# EAGLE design Moduł_Wyświetlacza (EAGLE 9.6.2)
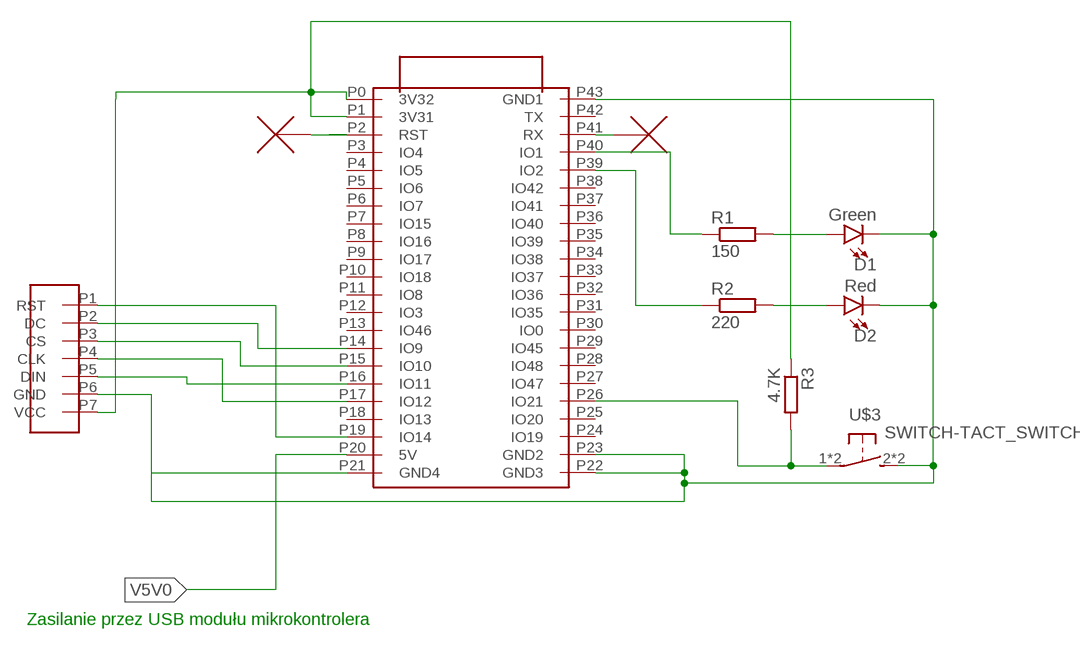
[diagram p0: schematic, sheet 1]

## Parts
D1  Green  SPARKFUN-LED_LED5MM  [SPARKFUN-LED_LED_5MM]
D2  Red  SPARKFUN-LED_LED5MM  [SPARKFUN-LED_LED_5MM]
R1  150  R-EU_0204/7  [0204/7]
R2  220  R-EU_0204/7  [0204/7]
R3  4.7K  R-EU_0204/7  [0204/7]
U$1  PROJEKT_SE5_ESP32-S3-DEVKIT  [PROJEKT_SE5_ESP32-S3-DEVKIT]
U$2  PROJEKT_SE5_OLED_MODULE  [PROJEKT_SE5_1.5INC_RGB_OLED]
U$3  SWITCH-TACT_SWITCH  [SWITCH-TACT_DTSM-6]
U$5  NC_MARKER_NC_MARKER  (no package)
U$6  NC_MARKER_NC_MARKER  (no package)

## Nets
N$2: D1.K(C) D2.K(C) U$1.P21(GND4) U$1.P22(GND3) U$1.P23(GND2) U$1.P43(GND1) U$2.P6(GND) U$3.2 U$3.4
N$3: U$1.P19(IO14) U$2.P1(RST)
N$4: U$1.P14(IO9) U$2.P2(DC)
N$5: U$1.P15(IO10) U$2.P3(CS)
N$6: U$1.P17(IO12) U$2.P4(CLK)
N$7: U$1.P16(IO11) U$2.P5(DIN)
N$8: R3.2 U$1.P26(IO21) U$3.1 U$3.3
N$9: U$1.P2(RST) U$5.P$1
N$10: D2.A R2.2
N$11: D1.A R1.2
N$12: R1.1 U$1.P40(IO1)
N$13: R2.1 U$1.P39(IO2)
N$15: U$1.P41(RX) U$6.P$1
N$16 [New Class]: R3.1 U$1.P0(3V32) U$1.P1(3V31) U$2.P7(VCC)
V5V0: U$1.P20(5V)
Unconnected: U$1.P3(IO4) U$1.P4(IO5) U$1.P5(IO6) U$1.P6(IO7) U$1.P7(IO15) U$1.P8(IO16) U$1.P9(IO17) U$1.P10(IO18) U$1.P11(IO8) U$1.P12(IO3) U$1.P13(IO46) U$1.P18(IO13) U$1.P24(IO19) U$1.P25(IO20) U$1.P27(IO47) U$1.P28(IO48) U$1.P29(IO45) U$1.P30(IO0) U$1.P31(IO35) U$1.P32(IO36) U$1.P33(IO37) U$1.P34(IO38) U$1.P35(IO39) U$1.P36(IO40) U$1.P37(IO41) U$1.P38(IO42) U$1.P42(TX)

## Notes on the sheet
- Zasilanie przez USB modułu mikrokontrolera

## Library data of the parts
D1 D2 = Library_Łukasz.Skowron:SPARKFUN-LED_LED: LED (Generic) Standard schematic elements and footprints for 5mm, 3mm, 1206, and 0603 sized LEDs. Generic LEDs with no color specified.
R1-R3 = rcl:R-EU_: RESISTOR, European symbol; SPICEPREFIX: R
U$1 = Library_Łukasz.Skowron:PROJEKT_SE5_ESP32-S3-DEVKIT
U$2 = Library_Łukasz.Skowron:PROJEKT_SE5_OLED_MODULE: 1.5inch RGB OLED Module Whaveshare
U$3 = Library_Łukasz.Skowron:SWITCH-TACT_SWITCH
U$5 U$6 = Library_Łukasz.Skowron:NC_MARKER_NC_MARKER

## Board
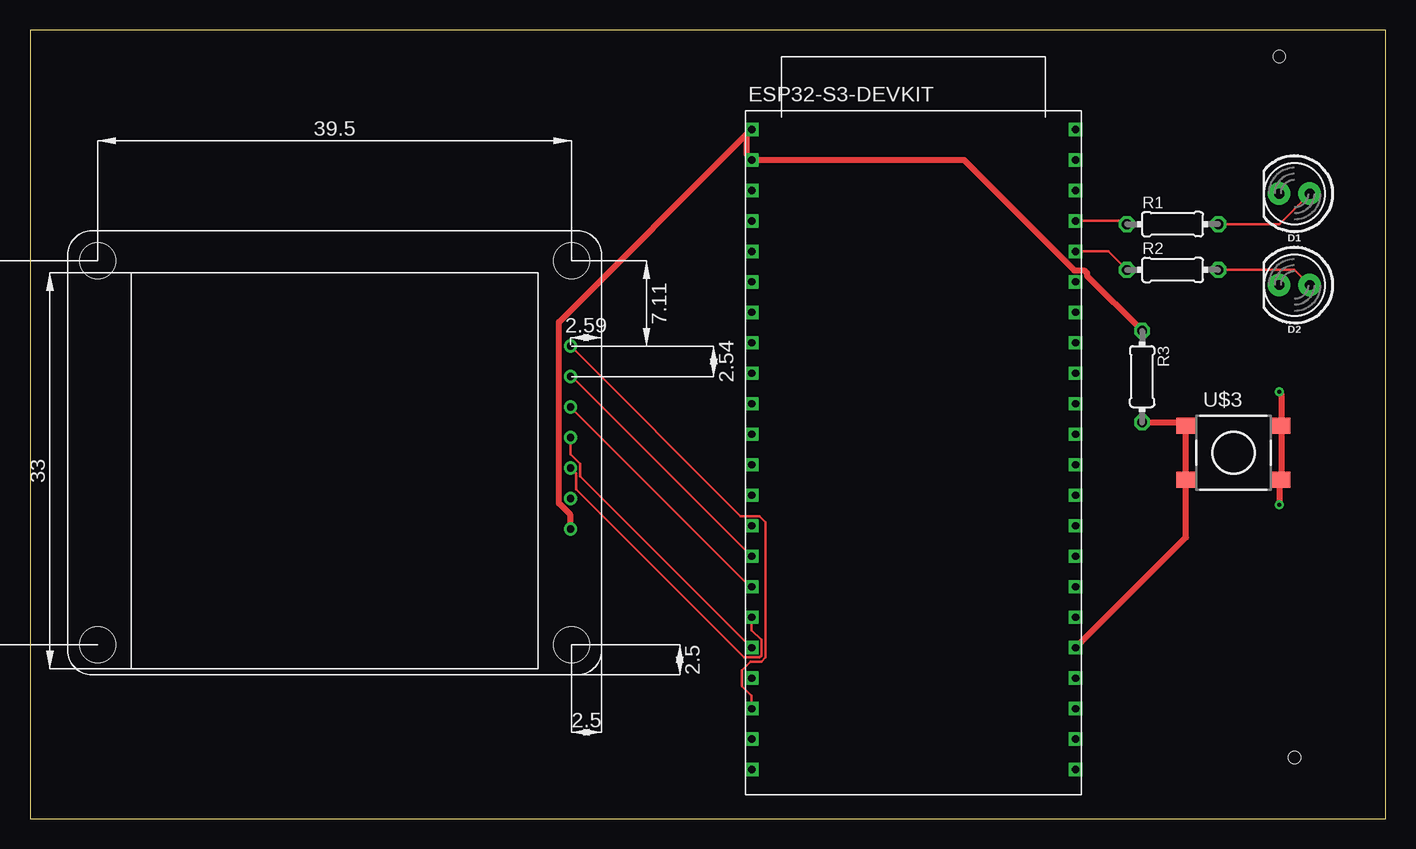
[diagram p1: board, top side]
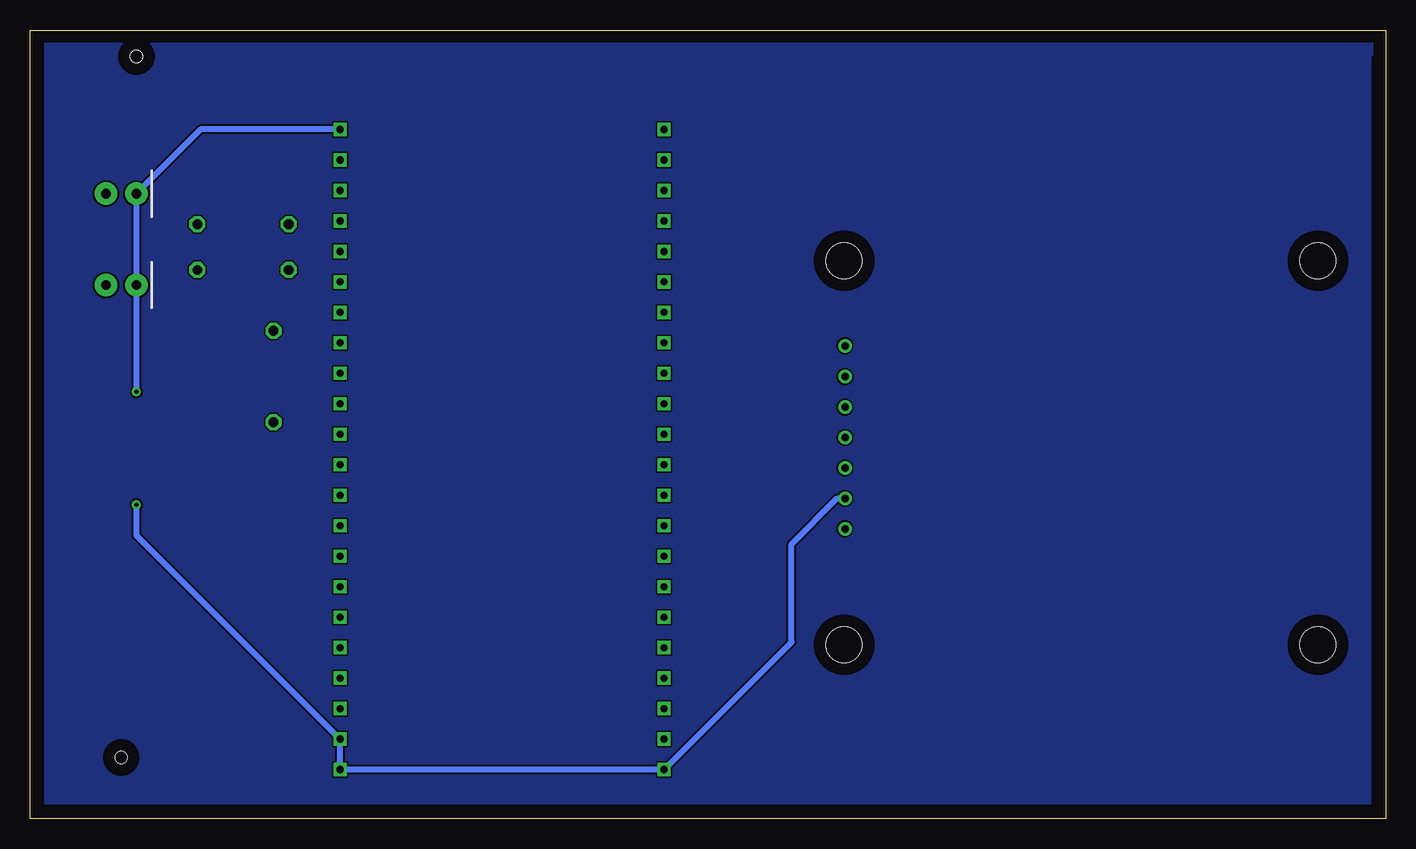
[diagram p2: board, bottom side, seen from below]

Size 113.01 x 65.71 mm. Coordinates in mm from the lower left corner, seen from the top.
Outline: 0,0 113.01,0 113.01,65.71 0,65.71 0,0
Copper layers (1*16): Top 0.035mm / dielectric 1.5mm / Bottom 0.035mm
Design rules "default": minimum track width 6mil, minimum drill 0.35mm, track to track 6mil, track to pad 6mil, pad to pad 6mil, via to via 6mil, smd to smd 6mil, copper to edge 40mil, drill to drill 6mil, minimum pad ring 10mil, minimum via ring 8mil, stop-mask expansion 4mil, vias tented up to drill 0mil, thermal gap 10mil
Holes 1 mm at 104.14,63.5 105.41,5.08

### Footprints (pad centres in the part's own frame; a part is rotated, then mirrored left to right if it is on the bottom)
SPARKFUN-LED_LED_5MM = drill 0.813 pad 1.88: A -1.27,0; K 1.27,0
0204/7 = drill 0.813 octagon: 1 -3.81,0; 2 3.81,0
PROJEKT_SE5_ESP32-S3-DEVKIT = drill 0.6 square: P0 -13.5,26.94; P1 -13.5,24.4; P2 -13.5,21.86; P3 -13.5,19.32; P4 -13.5,16.78; P5 -13.5,14.24; P6 -13.5,11.7; P7 -13.5,9.16; P8 -13.5,6.62; P9 -13.5,4.08; P10 -13.5,1.54; P11 -13.5,-1; P12 -13.5,-3.54; P13 -13.5,-6.08; P14 -13.5,-8.62; P15 -13.5,-11.16; P16 -13.5,-13.7; P17 -13.5,-16.24; P18 -13.5,-18.78; P19 -13.5,-21.32; P20 -13.5,-23.86; P21 -13.5,-26.4; P22 13.5,-26.4; P23 13.5,-23.86; P24 13.5,-21.32; P25 13.5,-18.78; P26 13.5,-16.24; P27 13.5,-13.7; P28 13.5,-11.16; P29 13.5,-8.62; P30 13.5,-6.08; P31 13.5,-3.54; P32 13.5,-1; P33 13.5,1.54; P34 13.5,4.08; P35 13.5,6.62; P36 13.5,9.16; P37 13.5,11.7; P38 13.5,14.24; P39 13.5,16.78; P40 13.5,19.32; P41 13.5,21.86; P42 13.5,24.4; P43 13.5,26.94
PROJEKT_SE5_1.5INC_RGB_OLED = drill 0.6: P1 -19.66,-8.9; P2 -19.66,-6.35; P3 -19.66,-3.81; P4 -19.66,-1.27; P5 -19.66,1.27; P6 -19.66,3.81; P7 -19.66,6.35 | hole 3: 19.75,16; 19.75,-16; -19.75,-16; -19.75,16
SWITCH-TACT_DTSM-6 = smd 1.55 x 1.3: 1 -3.975,2.25; 2 3.975,2.25; 3 -3.975,-2.25; 4 3.975,-2.25

### Placement (x,y rotation side)
D1  105.41,52.07 180 top
D2  105.41,44.45 180 top
R1  95.25,49.53 0 top
R2  95.25,45.72 0 top
R3  92.71,36.83 270 top
U$1  73.66,30.48 0 top
U$2  25.4,30.48 180 top
U$3  100.33,30.48 0 top

### Tracks (layer width: path | path; a pad name or v marks a point on that pad's centre or on a via)
GND
  pour Bottom: 0,64.77 111.76,64.77 111.76,1.27 1.27,1.27 1.27,63.5
N$2  (via drill 0.35)
  Top 0.508: v104.14,26.14 104.14,28.07 U$3.4 U$3.2 104.31,35.39 v104.14,35.56
  Bottom 0.508: U$2.P6 45.72,26.67 49.53,22.86 49.53,14.71 U$1.P21 U$1.P22 U$1.P23 104.14,23.6 v104.14,26.14 | U$1.P43 98.79,57.42 D1.K D2.K v104.14,35.56
N$3
  Top 0.203: U$1.P19 60.16,10.23 59.35,11.04 59.35,12.36 60.07,13.08 60.97,13.08 61.32,13.43 61.32,24.7 60.82,25.21 59.23,25.21 U$2.P1
N$4
  Top 0.203: U$1.P14 45.19,36.83 U$2.P2
N$5
  Top 0.203: U$2.P3 60.03,19.32 U$1.P15
N$6
  Top 0.203: U$2.P4 45.06,30.35 45.87,29.54 45.87,28.53 U$1.P17
N$7
  Top 0.203: U$2.P5 45.51,28.76 45.51,27.42 59.5,13.43 60.82,13.43 60.97,13.58 60.97,14.9 60.16,15.71 U$1.P16
N$8
  Top 0.508: R3.2 96.07,33.02 U$3.1 U$3.3 96.36,23.43 U$1.P26
N$10
  Top 0.203: R2.2 105.41,45.72 D2.A
N$11
  Top 0.203: R1.2 104.14,49.53 D1.A
N$12
  Top 0.203: U$1.P40 91.17,49.8 R1.1
N$13
  Top 0.203: U$1.P39 89.9,47.26 R2.1
N$16
  Top 0.508: R3.1 88.12,45.23 88.12,45.44 87.88,45.68 87.06,45.68 77.86,54.88 U$1.P1 59.79,55.25 59.79,57.05 | U$2.P7 45.06,25.31 44.1,26.27 44.1,41.36 59.79,57.05 | 59.79,57.05 U$1.P0